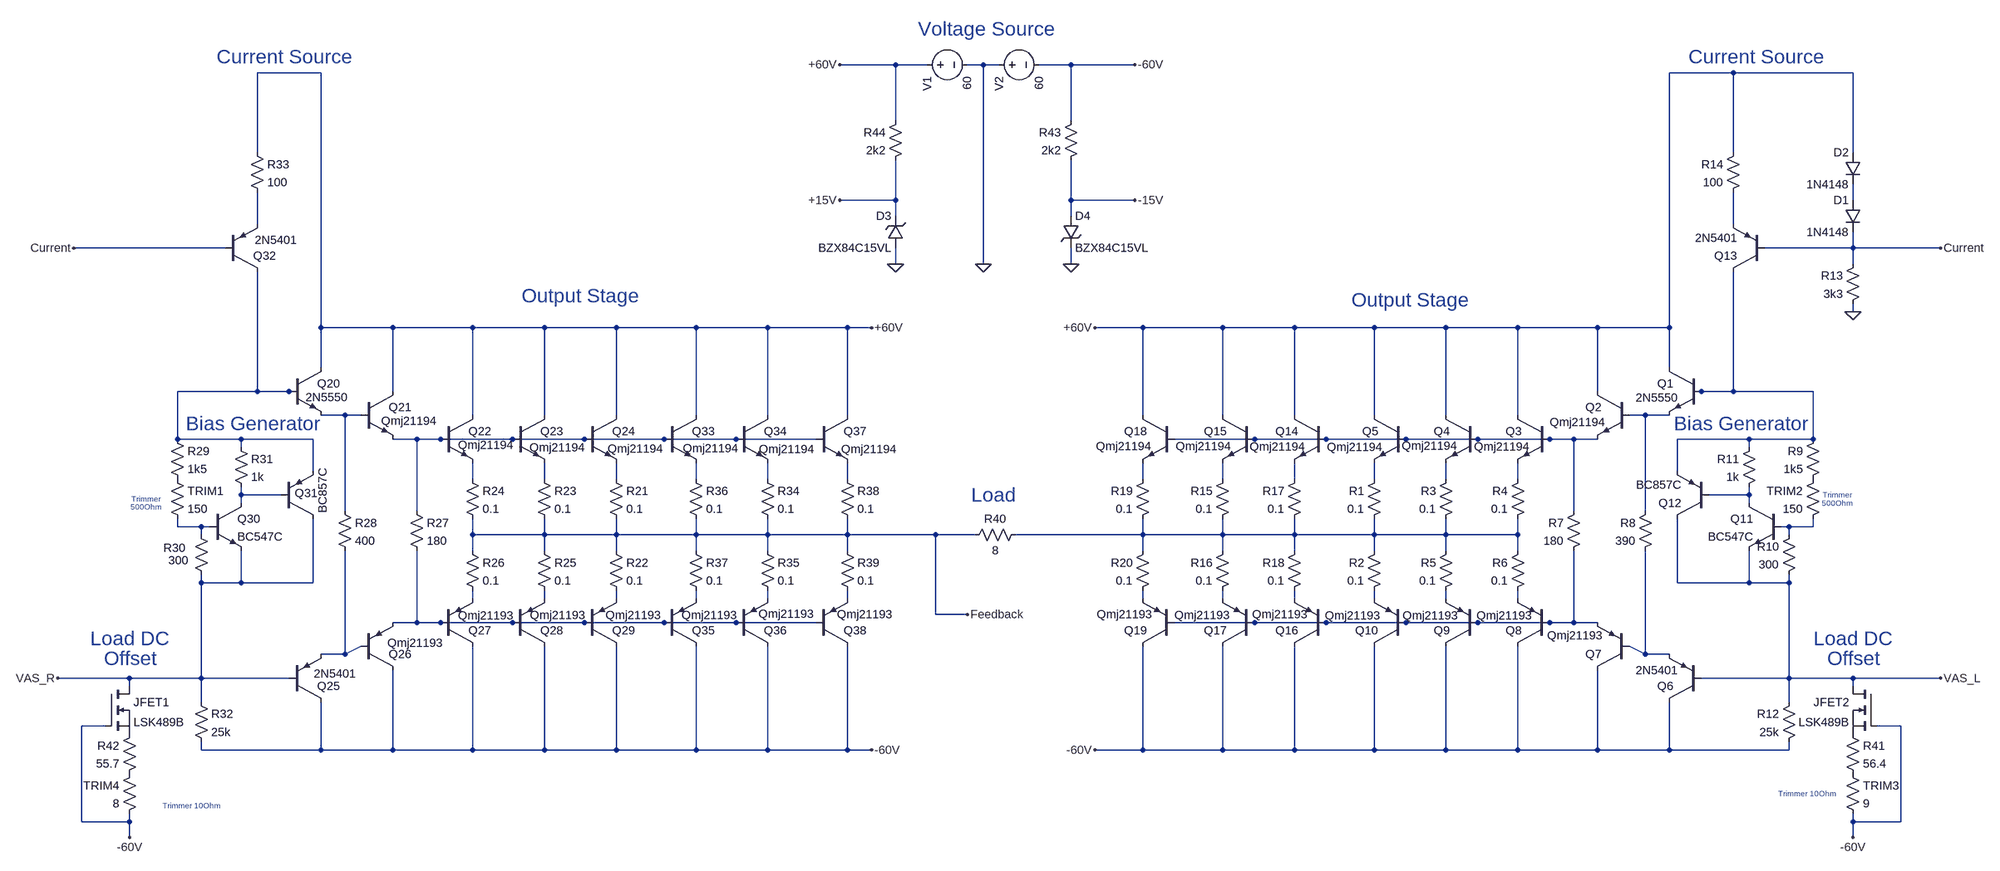
[diagram p0: schematic V12_TEX2.asc]
V12_TEX2.asc, the LTspice schematic file:
Version 4
SHEET 1 2616 1172
WIRE 416 -480 304 -480
WIRE 480 -480 416 -480
WIRE 592 -480 560 -480
WIRE 624 -480 592 -480
WIRE 768 -480 704 -480
WIRE 896 -480 768 -480
WIRE -736 -464 -864 -464
WIRE 2096 -464 1968 -464
WIRE 2336 -464 2096 -464
WIRE 416 -368 416 -480
WIRE 768 -368 768 -480
WIRE -864 -304 -864 -464
WIRE 2096 -304 2096 -464
WIRE 2336 -304 2336 -464
WIRE 416 -208 416 -288
WIRE 416 -208 304 -208
WIRE 768 -208 768 -288
WIRE 896 -208 768 -208
WIRE 2336 -208 2336 -240
WIRE 416 -176 416 -208
WIRE 768 -176 768 -208
WIRE -864 -160 -864 -224
WIRE 2096 -160 2096 -224
WIRE -928 -112 -1232 -112
WIRE 2336 -112 2336 -144
WIRE 2336 -112 2160 -112
WIRE 2512 -112 2336 -112
WIRE 416 -80 416 -112
WIRE 592 -80 592 -480
WIRE 768 -80 768 -112
WIRE 2336 -80 2336 -112
WIRE 2336 16 2336 0
WIRE -736 48 -736 -464
WIRE -592 48 -736 48
WIRE -432 48 -592 48
WIRE -288 48 -432 48
WIRE -144 48 -288 48
WIRE 16 48 -144 48
WIRE 160 48 16 48
WIRE 320 48 160 48
WIRE 368 48 320 48
WIRE 912 48 816 48
WIRE 1072 48 912 48
WIRE 1216 48 1072 48
WIRE 1376 48 1216 48
WIRE 1520 48 1376 48
WIRE 1664 48 1520 48
WIRE 1824 48 1664 48
WIRE 1968 48 1968 -464
WIRE 1968 48 1824 48
WIRE -736 128 -736 48
WIRE 1968 128 1968 48
WIRE -864 176 -864 -64
WIRE -864 176 -1024 176
WIRE -800 176 -864 176
WIRE -784 176 -800 176
WIRE -592 176 -592 48
WIRE 1824 176 1824 48
WIRE 2032 176 2016 176
WIRE 2096 176 2096 -64
WIRE 2096 176 2032 176
WIRE 2256 176 2096 176
WIRE -688 224 -736 224
WIRE -656 224 -688 224
WIRE -432 224 -432 48
WIRE -288 224 -288 48
WIRE -144 224 -144 48
WIRE 16 224 16 48
WIRE 160 224 160 48
WIRE 320 224 320 48
WIRE 912 224 912 48
WIRE 1072 224 1072 48
WIRE 1216 224 1216 48
WIRE 1376 224 1376 48
WIRE 1520 224 1520 48
WIRE 1664 224 1664 48
WIRE 1920 224 1888 224
WIRE 1968 224 1920 224
WIRE -1024 272 -1024 176
WIRE -896 272 -1024 272
WIRE -752 272 -896 272
WIRE -544 272 -592 272
WIRE -496 272 -544 272
WIRE -352 272 -496 272
WIRE -208 272 -352 272
WIRE -48 272 -208 272
WIRE 96 272 -48 272
WIRE 256 272 96 272
WIRE 1136 272 976 272
WIRE 1280 272 1136 272
WIRE 1440 272 1280 272
WIRE 1584 272 1440 272
WIRE 1728 272 1584 272
WIRE 1776 272 1728 272
WIRE 1824 272 1776 272
WIRE 2128 272 1984 272
WIRE 2256 272 2256 176
WIRE 2256 272 2128 272
WIRE -896 288 -896 272
WIRE 2128 288 2128 272
WIRE -752 336 -752 272
WIRE 1984 336 1984 272
WIRE -432 352 -432 320
WIRE -288 352 -288 320
WIRE -144 352 -144 320
WIRE 16 352 16 320
WIRE 160 352 160 320
WIRE 320 352 320 320
WIRE 912 352 912 320
WIRE 1072 352 1072 320
WIRE 1216 352 1216 320
WIRE 1376 352 1376 320
WIRE 1520 352 1520 320
WIRE 1664 352 1664 320
WIRE -896 384 -896 368
WIRE -816 384 -896 384
WIRE 2128 384 2128 368
WIRE 2128 384 2048 384
WIRE -896 400 -896 384
WIRE 2128 400 2128 384
WIRE -688 416 -688 224
WIRE -544 416 -544 272
WIRE 1776 416 1776 272
WIRE 1920 416 1920 224
WIRE -1024 448 -1024 432
WIRE -976 448 -1024 448
WIRE -960 448 -976 448
WIRE 2208 448 2192 448
WIRE 2256 448 2256 432
WIRE 2256 448 2208 448
WIRE -976 464 -976 448
WIRE -432 464 -432 432
WIRE -288 464 -288 432
WIRE -288 464 -432 464
WIRE -144 464 -144 432
WIRE -144 464 -288 464
WIRE 16 464 16 432
WIRE 16 464 -144 464
WIRE 160 464 160 432
WIRE 160 464 16 464
WIRE 320 464 320 432
WIRE 320 464 160 464
WIRE 496 464 320 464
WIRE 576 464 496 464
WIRE 912 464 912 432
WIRE 912 464 656 464
WIRE 1072 464 1072 432
WIRE 1072 464 912 464
WIRE 1216 464 1216 432
WIRE 1216 464 1072 464
WIRE 1376 464 1376 432
WIRE 1376 464 1216 464
WIRE 1520 464 1520 432
WIRE 1520 464 1376 464
WIRE 1664 464 1664 432
WIRE 1664 464 1520 464
WIRE 2208 464 2208 448
WIRE -432 496 -432 464
WIRE -288 496 -288 464
WIRE -144 496 -144 464
WIRE 16 496 16 464
WIRE 160 496 160 464
WIRE 320 496 320 464
WIRE 912 496 912 464
WIRE 1072 496 1072 464
WIRE 1216 496 1216 464
WIRE 1376 496 1376 464
WIRE 1520 496 1520 464
WIRE 1664 496 1664 464
WIRE -976 560 -976 544
WIRE -896 560 -896 496
WIRE -896 560 -976 560
WIRE -752 560 -752 432
WIRE -752 560 -896 560
WIRE 1984 560 1984 432
WIRE 2128 560 2128 496
WIRE 2128 560 1984 560
WIRE 2208 560 2208 544
WIRE 2208 560 2128 560
WIRE -432 592 -432 576
WIRE -288 592 -288 576
WIRE -144 592 -144 576
WIRE 16 592 16 576
WIRE 160 592 160 576
WIRE 320 592 320 576
WIRE 912 592 912 576
WIRE 1072 592 1072 576
WIRE 1216 592 1216 576
WIRE 1376 592 1376 576
WIRE 1520 592 1520 576
WIRE 1664 592 1664 576
WIRE 496 624 496 464
WIRE 560 624 496 624
WIRE -544 640 -544 496
WIRE -544 640 -592 640
WIRE -496 640 -544 640
WIRE -352 640 -496 640
WIRE -208 640 -352 640
WIRE -48 640 -208 640
WIRE 96 640 -48 640
WIRE 256 640 96 640
WIRE 1136 640 976 640
WIRE 1280 640 1136 640
WIRE 1440 640 1280 640
WIRE 1584 640 1440 640
WIRE 1728 640 1584 640
WIRE 1776 640 1776 496
WIRE 1776 640 1728 640
WIRE 1824 640 1776 640
WIRE -688 704 -688 496
WIRE -688 704 -656 688
WIRE -688 704 -736 704
WIRE 1920 704 1920 496
WIRE 1920 704 1888 688
WIRE 1968 704 1920 704
WIRE -1120 752 -1264 752
WIRE -976 752 -976 560
WIRE -976 752 -1120 752
WIRE -800 752 -976 752
WIRE 2208 752 2208 560
WIRE 2208 752 2032 752
WIRE 2336 752 2208 752
WIRE 2512 752 2336 752
WIRE -1120 768 -1120 752
WIRE 2336 768 2336 752
WIRE -976 800 -976 752
WIRE 2208 800 2208 752
WIRE -1168 848 -1216 848
WIRE 2432 848 2384 848
WIRE -976 896 -976 880
WIRE -736 896 -736 800
WIRE -736 896 -976 896
WIRE -592 896 -592 736
WIRE -592 896 -736 896
WIRE -432 896 -432 688
WIRE -432 896 -592 896
WIRE -288 896 -288 688
WIRE -288 896 -432 896
WIRE -144 896 -144 688
WIRE -144 896 -288 896
WIRE 16 896 16 688
WIRE 16 896 -144 896
WIRE 160 896 160 688
WIRE 160 896 16 896
WIRE 320 896 320 688
WIRE 320 896 160 896
WIRE 368 896 320 896
WIRE 912 896 912 688
WIRE 912 896 816 896
WIRE 1072 896 1072 688
WIRE 1072 896 912 896
WIRE 1216 896 1216 688
WIRE 1216 896 1072 896
WIRE 1376 896 1376 688
WIRE 1376 896 1216 896
WIRE 1520 896 1520 688
WIRE 1520 896 1376 896
WIRE 1664 896 1664 688
WIRE 1664 896 1520 896
WIRE 1824 896 1824 736
WIRE 1824 896 1664 896
WIRE 1968 896 1968 800
WIRE 1968 896 1824 896
WIRE 2208 896 2208 880
WIRE 2208 896 1968 896
WIRE -1216 1040 -1216 848
WIRE -1120 1040 -1120 1024
WIRE -1120 1040 -1216 1040
WIRE 2336 1040 2336 1024
WIRE 2432 1040 2432 848
WIRE 2432 1040 2336 1040
WIRE -1120 1072 -1120 1040
WIRE 2336 1072 2336 1040
FLAG 592 -80 0
FLAG 304 -480 +60V
FLAG 896 -480 -60V
FLAG 2336 16 0
FLAG 816 896 -60V
FLAG 816 48 +60V
FLAG 368 896 -60V
FLAG 368 48 +60V
FLAG 416 -80 0
FLAG 768 -80 0
FLAG 304 -208 +15V
FLAG 896 -208 -15V
FLAG -1232 -112 Current
FLAG 2512 -112 Current
FLAG 2336 1072 -60V
FLAG -1120 1072 -60V
FLAG -1264 752 VAS_R
FLAG 2512 752 VAS_L
FLAG 560 624 Feedback
SYMBOL voltage 464 -480 M90
WINDOW 123 0 0 Left 0
WINDOW 39 24 44 Left 2
SYMATTR InstName V1
SYMATTR Value 60
SYMBOL voltage 608 -480 M90
WINDOW 123 0 0 Left 0
WINDOW 39 24 124 Left 2
SYMATTR InstName V2
SYMATTR Value 60
SYMBOL npn 2032 128 M0
WINDOW 3 47 61 Left 2
SYMATTR Value 2N5550
SYMATTR InstName Q1
SYMBOL npn 1888 176 M0
WINDOW 3 48 62 Left 2
SYMATTR Value Qmj21194
SYMATTR InstName Q2
SYMBOL npn 1728 224 M0
WINDOW 3 40 63 Left 2
SYMATTR Value Qmj21194
SYMATTR InstName Q3
SYMBOL npn 1584 224 M0
WINDOW 3 41 61 Left 2
SYMATTR Value Qmj21194
SYMATTR InstName Q4
SYMBOL npn 1440 224 M0
WINDOW 3 47 64 Left 2
SYMATTR Value Qmj21194
SYMATTR InstName Q5
SYMBOL pnp 2032 800 R180
WINDOW 3 47 64 Left 2
SYMATTR Value 2N5401
SYMATTR InstName Q6
SYMBOL pnp 1888 736 R180
WINDOW 3 53 70 Left 2
SYMATTR Value Qmj21193
SYMATTR InstName Q7
SYMBOL pnp 1728 688 R180
WINDOW 3 35 62 Left 2
SYMATTR Value Qmj21193
SYMATTR InstName Q8
SYMBOL pnp 1584 688 R180
WINDOW 3 39 62 Left 2
SYMATTR Value Qmj21193
SYMATTR InstName Q9
SYMBOL pnp 1440 688 R180
WINDOW 3 51 62 Left 2
SYMATTR Value Qmj21193
SYMATTR InstName Q10
SYMBOL res 1392 336 M0
SYMATTR InstName R1
SYMATTR Value 0.1
SYMBOL res 1392 480 M0
SYMATTR InstName R2
SYMATTR Value 0.1
SYMBOL res 1536 336 M0
SYMATTR InstName R3
SYMATTR Value 0.1
SYMBOL res 1680 336 M0
SYMATTR InstName R4
SYMATTR Value 0.1
SYMBOL res 1536 480 M0
SYMATTR InstName R5
SYMATTR Value 0.1
SYMBOL res 1680 480 M0
SYMATTR InstName R6
SYMATTR Value 0.1
SYMBOL res 1792 400 M0
SYMATTR InstName R7
SYMATTR Value 180
SYMBOL res 1936 400 M0
SYMATTR InstName R8
SYMATTR Value 390
SYMBOL npn 2192 400 M0
SYMATTR InstName Q11
SYMATTR Value BC547C
SYMBOL res 2272 256 M0
SYMATTR InstName R9
SYMATTR Value 1k5
SYMBOL res 2224 448 M0
SYMATTR InstName R10
SYMATTR Value 300
SYMBOL res 2144 272 M0
SYMATTR InstName R11
SYMATTR Value 1k
SYMBOL pnp 2048 432 R180
SYMATTR InstName Q12
SYMATTR Value BC857C
SYMBOL res 2224 784 M0
SYMATTR InstName R12
SYMATTR Value 25k
SYMBOL pnp 2160 -64 R180
SYMATTR InstName Q13
SYMATTR Value 2N5401
SYMBOL res 2352 -96 M0
SYMATTR InstName R13
SYMATTR Value 3k3
SYMBOL diode 2352 -208 M0
SYMATTR InstName D1
SYMATTR Value 1N4148
SYMBOL diode 2352 -304 M0
SYMATTR InstName D2
SYMATTR Value 1N4148
SYMBOL res 2112 -320 M0
SYMATTR InstName R14
SYMATTR Value 100
SYMBOL npn 1280 224 M0
WINDOW 3 42 63 Left 2
SYMATTR Value Qmj21194
SYMATTR InstName Q14
SYMBOL npn 1136 224 M0
WINDOW 3 46 62 Left 2
SYMATTR Value Qmj21194
SYMATTR InstName Q15
SYMBOL pnp 1280 688 R180
WINDOW 3 37 64 Left 2
SYMATTR Value Qmj21193
SYMATTR InstName Q16
SYMBOL pnp 1136 688 R180
WINDOW 3 49 63 Left 2
SYMATTR Value Qmj21193
SYMATTR InstName Q17
SYMBOL res 1088 336 M0
SYMATTR InstName R15
SYMATTR Value 0.1
SYMBOL res 1088 480 M0
SYMATTR InstName R16
SYMATTR Value 0.1
SYMBOL res 1232 336 M0
SYMATTR InstName R17
SYMATTR Value 0.1
SYMBOL res 1232 480 M0
SYMATTR InstName R18
SYMATTR Value 0.1
SYMBOL npn 976 224 M0
WINDOW 3 46 62 Left 2
SYMATTR Value Qmj21194
SYMATTR InstName Q18
SYMBOL pnp 976 688 R180
WINDOW 3 45 64 Left 2
SYMATTR Value Qmj21193
SYMATTR InstName Q19
SYMBOL res 928 336 M0
SYMATTR InstName R19
SYMATTR Value 0.1
SYMBOL res 928 480 M0
SYMATTR InstName R20
SYMATTR Value 0.1
SYMBOL npn -800 128 R0
WINDOW 3 33 60 Left 2
SYMATTR Value 2N5550
SYMATTR InstName Q20
SYMBOL npn -656 176 R0
WINDOW 3 41 59 Left 2
SYMATTR Value Qmj21194
SYMATTR InstName Q21
SYMBOL npn -496 224 R0
WINDOW 3 35 60 Left 2
SYMATTR Value Qmj21194
SYMATTR InstName Q22
SYMBOL npn -352 224 R0
WINDOW 3 34 65 Left 2
SYMATTR Value Qmj21194
SYMATTR InstName Q23
SYMBOL npn -208 224 R0
WINDOW 3 47 67 Left 2
SYMATTR Value Qmj21194
SYMATTR InstName Q24
SYMBOL pnp -800 800 M180
WINDOW 3 50 57 Left 2
SYMATTR Value 2N5401
SYMATTR InstName Q25
SYMBOL pnp -656 736 M180
WINDOW 3 53 55 Left 2
SYMATTR Value Qmj21193
SYMATTR InstName Q26
SYMBOL pnp -496 688 M180
WINDOW 3 35 62 Left 2
SYMATTR Value Qmj21193
SYMATTR InstName Q27
SYMBOL pnp -352 688 M180
WINDOW 3 35 63 Left 2
SYMATTR Value Qmj21193
SYMATTR InstName Q28
SYMBOL pnp -208 688 M180
WINDOW 3 43 63 Left 2
SYMATTR Value Qmj21193
SYMATTR InstName Q29
SYMBOL res -160 336 R0
SYMATTR InstName R21
SYMATTR Value 0.1
SYMBOL res -160 480 R0
SYMATTR InstName R22
SYMATTR Value 0.1
SYMBOL res -304 336 R0
SYMATTR InstName R23
SYMATTR Value 0.1
SYMBOL res -448 336 R0
SYMATTR InstName R24
SYMATTR Value 0.1
SYMBOL res -304 480 R0
SYMATTR InstName R25
SYMATTR Value 0.1
SYMBOL res -448 480 R0
SYMATTR InstName R26
SYMATTR Value 0.1
SYMBOL res -560 400 R0
SYMATTR InstName R27
SYMATTR Value 180
SYMBOL res -704 400 R0
SYMATTR InstName R28
SYMATTR Value 400
SYMBOL npn -960 400 R0
SYMATTR InstName Q30
SYMATTR Value BC547C
SYMBOL res -1040 256 R0
SYMATTR InstName R29
SYMATTR Value 1k5
SYMBOL res -992 448 R0
WINDOW 0 -60 42 Left 2
WINDOW 3 -50 67 Left 2
SYMATTR InstName R30
SYMATTR Value 300
SYMBOL res -912 272 R0
SYMATTR InstName R31
SYMATTR Value 1k
SYMBOL pnp -816 432 M180
WINDOW 0 27 52 Left 2
WINDOW 3 84 11 VRight 2
SYMATTR InstName Q31
SYMATTR Value BC857C
SYMBOL res -992 784 R0
SYMATTR InstName R32
SYMATTR Value 25k
SYMBOL pnp -928 -64 M180
WINDOW 3 59 64 Left 2
SYMATTR Value 2N5401
SYMATTR InstName Q32
SYMBOL res -880 -320 R0
SYMATTR InstName R33
SYMATTR Value 100
SYMBOL npn -48 224 R0
WINDOW 3 38 66 Left 2
SYMATTR Value Qmj21194
SYMATTR InstName Q33
SYMBOL npn 96 224 R0
WINDOW 3 46 68 Left 2
SYMATTR Value Qmj21194
SYMATTR InstName Q34
SYMBOL pnp -48 688 M180
WINDOW 3 35 63 Left 2
SYMATTR Value Qmj21193
SYMATTR InstName Q35
SYMBOL pnp 96 688 M180
WINDOW 3 45 65 Left 2
SYMATTR Value Qmj21193
SYMATTR InstName Q36
SYMBOL res 144 336 R0
SYMATTR InstName R34
SYMATTR Value 0.1
SYMBOL res 144 480 R0
SYMATTR InstName R35
SYMATTR Value 0.1
SYMBOL res 0 336 R0
SYMATTR InstName R36
SYMATTR Value 0.1
SYMBOL res 0 480 R0
SYMATTR InstName R37
SYMATTR Value 0.1
SYMBOL npn 256 224 R0
WINDOW 3 51 68 Left 2
SYMATTR Value Qmj21194
SYMATTR InstName Q37
SYMBOL pnp 256 688 M180
WINDOW 3 43 64 Left 2
SYMATTR Value Qmj21193
SYMATTR InstName Q38
SYMBOL res 304 336 R0
SYMATTR InstName R38
SYMATTR Value 0.1
SYMBOL res 304 480 R0
SYMATTR InstName R39
SYMATTR Value 0.1
SYMBOL res 672 448 R90
WINDOW 0 0 56 VBottom 2
WINDOW 3 32 56 VTop 2
SYMATTR InstName R40
SYMATTR Value 8
SYMBOL zener 432 -112 R180
WINDOW 0 24 64 Left 2
WINDOW 3 24 0 Left 2
SYMATTR InstName D3
SYMATTR Value BZX84C15VL
SYMBOL zener 752 -176 R0
SYMATTR InstName D4
SYMATTR Value BZX84C15VL
SYMBOL res -1040 336 R0
SYMATTR InstName TRIM1
SYMATTR Value 150
SYMBOL res 2272 336 M0
SYMATTR InstName TRIM2
SYMATTR Value 150
SYMBOL res 2320 848 R0
SYMATTR InstName R41
SYMATTR Value 56.4
SYMBOL res 2320 928 R0
SYMATTR InstName TRIM3
SYMATTR Value 9
SYMBOL res -1104 848 M0
SYMATTR InstName R42
SYMATTR Value 55.7
SYMBOL res -1104 928 M0
SYMATTR InstName TRIM4
SYMATTR Value 8
SYMBOL res 784 -384 M0
SYMATTR InstName R43
SYMATTR Value 2k2
SYMBOL res 432 -384 M0
SYMATTR InstName R44
SYMATTR Value 2k2
SYMBOL nmos -1168 768 R0
SYMATTR InstName JFET1
SYMATTR Value LSK489B
SYMBOL nmos 2384 768 M0
SYMATTR InstName JFET2
SYMATTR Value LSK489B
TEXT 736 -552 Right 4 ;Voltage Source
TEXT 1568 -8 Right 4 ;Output Stage
TEXT -96 -16 Right 4 ;Output Stage
TEXT 568 384 Left 4 ;Load
TEXT 2416 672 Right 4 ;Load DC
TEXT 2280 -496 Right 4 ;Current Source
TEXT -672 -496 Right 4 ;Current Source
TEXT 2248 240 Right 4 ;Bias Generator
TEXT -736 240 Right 4 ;Bias Generator
TEXT 2392 712 Right 4 ;Offset
TEXT -1040 672 Right 4 ;Load DC
TEXT -1064 712 Right 4 ;Offset
TEXT -1056 392 Right 1 ;Trimmer
TEXT -936 1008 Right 1 ;Trimmer 10Ohm
TEXT 2304 984 Right 1 ;Trimmer 10Ohm
TEXT -1056 408 Right 1 ;500Ohm
TEXT 2336 384 Right 1 ;Trimmer
TEXT 2336 400 Right 1 ;500Ohm

The netlist it stands for:
* V12_TEX2.asc
V1 +60V 0 60
V2 0 -60V 60
Q1 +60V N005 N007 0 2N5550
Q2 +60V N007 N009 0 Qmj21194
Q3 +60V N009 N021 0 Qmj21194
Q4 +60V N009 N020 0 Qmj21194
Q5 +60V N009 N019 0 Qmj21194
Q6 -60V VAS_L N042 0 2N5401
Q7 -60V N042 N040 0 Qmj21193
Q8 -60V N040 N038 0 Qmj21193
Q9 -60V N040 N037 0 Qmj21193
Q10 -60V N040 N036 0 Qmj21193
R1 N019 N026 0.1
R2 N026 N036 0.1
R3 N020 N026 0.1
R4 N021 N026 0.1
R5 N026 N037 0.1
R6 N026 N038 0.1
R7 N009 N040 180
R8 N007 N042 390
Q11 N023 N025 VAS_L 0 BC547C
R9 N005 P001 1k5
R10 N025 VAS_L 300
R11 N005 N023 1k
Q12 VAS_L N023 N005 0 BC857C
R12 VAS_L -60V 25k
Q13 N005 Current N003 0 2N5401
R13 Current 0 3k3
D1 N001 Current 1N4148
D2 +60V N001 1N4148
R14 +60V N003 100
Q14 +60V N009 N018 0 Qmj21194
Q15 +60V N009 N017 0 Qmj21194
Q16 -60V N040 N035 0 Qmj21193
Q17 -60V N040 N034 0 Qmj21193
R15 N017 N026 0.1
R16 N026 N034 0.1
R17 N018 N026 0.1
R18 N026 N035 0.1
Q18 +60V N009 N016 0 Qmj21194
Q19 -60V N040 N033 0 Qmj21193
R19 N016 N026 0.1
R20 N026 N033 0.1
Q20 +60V N004 N006 0 2N5550
Q21 +60V N006 N008 0 Qmj21194
Q22 +60V N008 N010 0 Qmj21194
Q23 +60V N008 N011 0 Qmj21194
Q24 +60V N008 N012 0 Qmj21194
Q25 -60V VAS_R N041 0 2N5401
Q26 -60V N041 N039 0 Qmj21193
Q27 -60V N039 N027 0 Qmj21193
Q28 -60V N039 N028 0 Qmj21193
Q29 -60V N039 N029 0 Qmj21193
R21 N012 Feedback 0.1
R22 Feedback N029 0.1
R23 N011 Feedback 0.1
R24 N010 Feedback 0.1
R25 Feedback N028 0.1
R26 Feedback N027 0.1
R27 N008 N039 180
R28 N006 N041 400
Q30 N022 N024 VAS_R 0 BC547C
R29 N004 P002 1k5
R30 N024 VAS_R 300
R31 N004 N022 1k
Q31 VAS_R N022 N004 0 BC857C
R32 VAS_R -60V 25k
Q32 N004 Current N002 0 2N5401
R33 +60V N002 100
Q33 +60V N008 N013 0 Qmj21194
Q34 +60V N008 N014 0 Qmj21194
Q35 -60V N039 N030 0 Qmj21193
Q36 -60V N039 N031 0 Qmj21193
R34 N014 Feedback 0.1
R35 Feedback N031 0.1
R36 N013 Feedback 0.1
R37 Feedback N030 0.1
Q37 +60V N008 N015 0 Qmj21194
Q38 -60V N039 N032 0 Qmj21193
R38 N015 Feedback 0.1
R39 Feedback N032 0.1
R40 N026 Feedback 8
D3 0 +15V BZX84C15VL
D4 -15V 0 BZX84C15VL
R§TRIM1 P002 N024 150
R§TRIM2 P001 N025 150
R41 P003 P004 56.4
R§TRIM3 P004 -60V 9
R42 P005 P006 55.7
R§TRIM4 P006 -60V 8
R43 -60V -15V 2k2
R44 +60V +15V 2k2
M§JFET1 VAS_R -60V P005 P005 LSK489B
M§JFET2 VAS_L -60V P003 P003 LSK489B
.model D D
.lib standard.dio
.model NPN NPN
.model PNP PNP
.lib standard.bjt
.model NMOS NMOS
.model PMOS PMOS
.lib standard.mos
* Voltage Source
* Output Stage
* Output Stage
* Load
* Load DC
* Current Source
* Current Source
* Bias Generator
* Bias Generator
* Offset
* Load DC
* Offset
* Trimmer
* Trimmer 10Ohm
* Trimmer 10Ohm
* 500Ohm
* Trimmer
* 500Ohm
.backanno
.end